# EAGLE design Experimento (EAGLE 9.6.2)
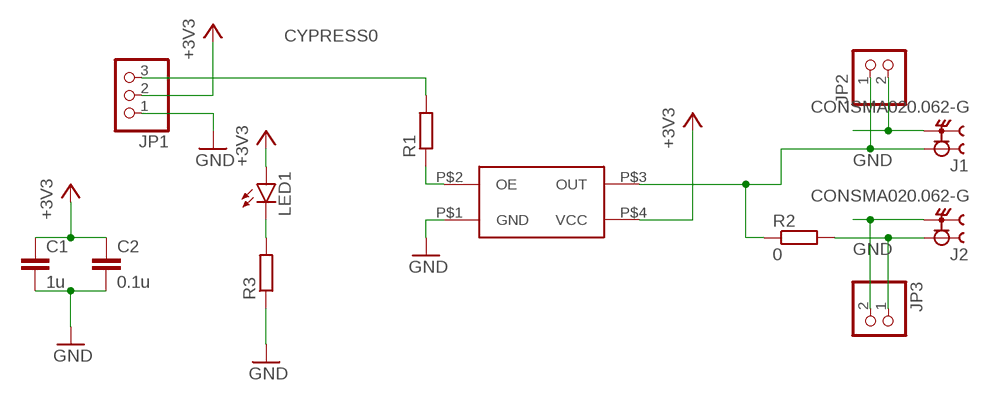
[diagram p0: schematic, sheet 1]

## Parts
C1  1u  C-EUC0805  [C0805]
C2  0.1u  C-EUC0805  [C0805]
J1  CONSMA020.062-G  [LINX_CONSMA020.062-G]
J2  CONSMA020.062-G  [LINX_CONSMA020.062-G]
JP1  PINHD-1X3  [1X03]
JP2  PINHD-1X2M  [1X02M]
JP3  PINHD-1X2M  [1X02M]
LED1  LEDSML0603  [SML0603]
R1  R-EU_R0603  [R0603]
R2  0  R-EU_R1206  [R1206]
R3  R-EU_R0805  [R0805]
U$1  732-XG1000CA100CBL3  [732-XG1000CA100CBL3]

## Nets
+3V3: C1.1 C2.1 JP1.2 LED1.A U$1.P$4(VCC)
CYPRESS0: JP1.3 R1.2
GND: C1.2 C2.2 J1.S1 J1.S2 J1.S3 J1.S4 J2.S1 J2.S2 J2.S3 J2.S4 JP1.1 JP2.2 JP3.2 R3.1 U$1.P$1(GND)
N$1: J2.1 JP3.1 R2.2
N$2: LED1.C R3.2
N$4: R1.1 U$1.P$2(OE)
SAW0: J1.1 JP2.1 R2.1 U$1.P$3(OUT)

## Library data of the parts
C1 C2 = rcl:C-EU: CAPACITOR, European symbol; SPICEPREFIX: C
J1 J2 = CONSMA020.062-G:CONSMA020.062-G: SMA FEMALE EDGE MOUNT FOR 0.062" BOARD, GOLD; DESCRIPTION: SMA Edge Mount Female Receptacle 0.062 PCB Mount, Gold; DIGI-KEY_PART_NUMBER: 343-CONSMA020.062-G-ND; MF: Linx Technologies; MP: CONSMA020.062-G; PACKAGE: None; PURCHASE-URL: https://pricing.snapeda.com/search/part/CONSMA020.062-G/?ref=eda
JP1 = pinhead:PINHD-1X3: PIN HEADER
JP2 JP3 = pinhead:PINHD-1X2: PIN HEADER
LED1 = led:LED: LED OSRAM: - CHIPLED LG R971, LG N971, LY N971, LG Q971, LY Q971, LO R971, LY R971 LH N974, LH R974 LS Q976, LO Q976, LY Q976 LO Q996 - Hyper CHIPLED LW Q18S LB Q993, LB Q99A, LB R99A - SideLED LS A670, LO A670, LY A670, LG A670, LP A670 LB A673, LV A673, LT A673, LW A673 LH A674 LY A675 LS A676, LA A676, LO A676, LY A676, LW A676 LS A679, LY A679, LG A679 - Hyper Micro SIDELED® LS Y876, LA Y876, LO Y876, LY Y876 LT Y87S - SmartLED LW L88C, LW L88S LB L89C, LB L89S, LG L890 LS L89K, LO L89K, LY L89K LS L896, LA L896, LO L896, LY L896 - TOPLED LS T670, LO T670, LY T670, LG T670, LP T670 LSG T670, LSP T670, LSY T670, LOP T670, LYG T670 LG T671, LOG T671, LSG T671 LB T673, LV T673, LT T673, LW T673 LH T674 LS T676, LA T676, LO T676, LY T676, LB T676, LH T676, LSB T676, LW T676 LB T67C, LV T67C, LT T67C, LS T67K, LO T67K, LY T67K, LW E67C LS E67B, LA E67B, LO E67B, LY E67B, LB E67C, LV E67C, LT E67C LW T67C LS T679, LY T679, LG T679 LS T770, LO T770, LY T770, LG T770, LP T770 LB T773, LV T773, LT T773, LW T773 LH T774 LS E675, LA E675, LY E675, LS T675 LS T776, LA T776, LO T776, LY T776, LB T776 LHGB T686 LT T68C, LB T68C - Hyper Mini TOPLED® LB M676 - Mini TOPLED Santana® LG M470 LS M47K, LO M47K, LY M47K Source: http://www.osram.convergy.de LUXEON: - LUMILED® LXK2-PW12-R00, LXK2-PW12-S00, LXK2-PW14-U00, LXK2-PW14-V00 LXK2-PM12-R00, LXK2-PM12-S00, LXK2-PM14-U00 LXK2-PE12-Q00, LXK2-PE12-R00, LXK2-PE12-S00, LXK2-PE14-T00, LXK2-PE14-U00 LXK2-PB12-K00, LXK2-PB12-L00, LXK2-PB12-M00, LXK2-PB14-N00, LXK2-PB14-P00, LXK2-PB14-Q00 LXK2-PR12-L00, LXK2-PR12-M00, LXK2-PR14-Q00, LXK2-PR14-R00 LXK2-PD12-Q00, LXK2-PD12-R00, LXK2-PD12-S00 LXK2-PH12-R00, LXK2-PH12-S00 LXK2-PL12-P00, LXK2-PL12-Q00, LXK2-PL12-R00 Source: www.luxeon.com KINGBRIGHT: KA-3528ASYC Source: www.kingbright.com
R1-R3 = rcl:R-EU_: RESISTOR, European symbol; SPICEPREFIX: R
U$1 = XG-1000CA:732-XG1000CA100CBL3

## Board
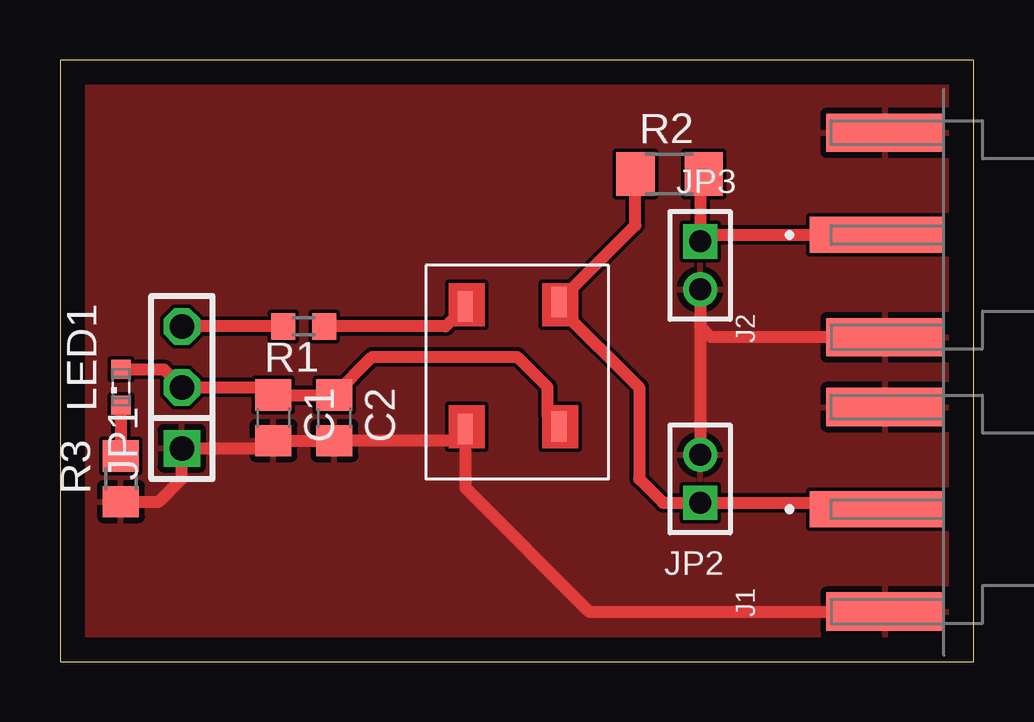
[diagram p1: board, top side]
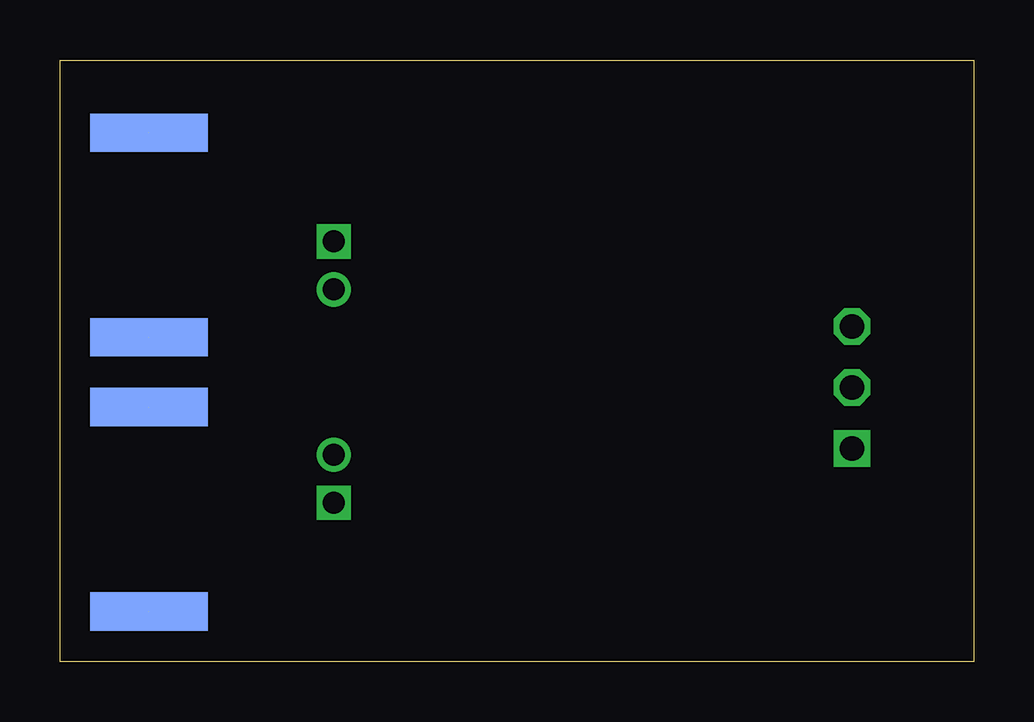
[diagram p2: board, bottom side, seen from below]

Size 38.08 x 25.07 mm. Coordinates in mm from the lower left corner, seen from the top.
Outline: 0,0 38.08,0 38.08,25.07 0,25.07 0,0
Copper layers (1*16): Top 0.035mm / dielectric 1.5mm / Bottom 0.035mm
Design rules "default": minimum track width 6mil, minimum drill 0.35mm, track to track 6mil, track to pad 6mil, pad to pad 6mil, via to via 6mil, smd to smd 6mil, copper to edge 40mil, drill to drill 6mil, minimum pad ring 10mil, minimum via ring 8mil, stop-mask expansion 4mil, vias tented up to drill 0mil, thermal gap 10mil

### Footprints (pad centres in the part's own frame; a part is rotated, then mirrored left to right if it is on the bottom)
C0805 = smd 1.3 x 1.5: 1 -0.95,0; 2 0.95,0
LINX_CONSMA020.062-G = smd 1.5 x 5.6: 1 0,2.8 | smd 1.6 x 4.9: S1 -4.26,2.45; S2 4.26,2.45 | smd 1.6 x 4.9 bottom: S3 -4.26,2.45; S4 4.26,2.45
1X03 = drill 1.016 square: 1 -2.54,0 | drill 1.016 octagon: 2 0,0; 3 2.54,0
1X02M = drill 0.914 square: 1 -1,0 | drill 0.914: 2 1,0
SML0603 = smd 0.8 x 0.8: A 0.75,0; C -0.75,0
R0603 = smd 1 x 1.1: 1 -0.85,0; 2 0.85,0
R1206 = smd 1.6 x 1.803: 1 -1.422,0; 2 1.422,0
R0805 = smd 1.3 x 1.5: 1 -0.95,0; 2 0.95,0
732-XG1000CA100CBL3 = smd 1.27 x 0.635: P$1 0.8,4.7; P$2 5.9,4.7; P$3 6.1,0.8; P$4 0.9,0.8

### Placement (x,y rotation side)
C1  8.89,10.16 270 top
C2  11.43,10.16 270 top
J1  36.83,6.35 90 top
J2  36.83,17.78 90 top
JP1  5.08,11.43 90 top
JP2  26.67,7.62 90 top
JP3  26.67,16.51 270 top
LED1  2.54,11.43 90 top
R1  10.16,13.97 180 top
R2  25.4,20.32 0 top
R3  2.54,7.62 90 top
U$1  21.59,8.89 90 top

### Tracks (layer width: path | path; a pad name or v marks a point on that pad's centre or on a via)
+3V3
  Top 0.508: LED1.A 4.33,12.18 JP1.2 8.57,11.43 C1.1 C2.1 13.02,12.7 19.05,12.7 20.32,11.43 20.32,10.26 U$1.P$4
CYPRESS0
  Top 0.508: R1.2 JP1.3
GND  (4 unrouted)
  Top 0.508: R3.1 4.13,6.67 5.08,7.62 JP1.1 8.57,8.89 C1.2 C2.2 16.41,9.21 U$1.P$1 16.89,7.24 22.04,2.09 J1.S1 | JP3.2 26.67,13.97 | 26.67,13.97 JP2.2 | J2.S1 27.12,13.52 26.67,13.97
  pour Top: 0,0 0,25.4 38.1,25.4 38.1,0
N$1
  Top 0.508: R2.2 26.67,20.17 JP3.1 26.94,17.78 J2.1 34.29,17.78
N$2
  Top 0.508: LED1.C R3.2
N$4
  Top 0.508: U$1.P$2 16.07,13.97 R1.1
SAW0
  Top 0.508: J1.1 33.76,6.62 JP2.1 25.13,6.62 24.13,7.62 24.13,11.43 20.79,14.77 U$1.P$3 23.98,18.18 R2.1